# Altium schematic sheet Plasma Speaker H-Bridge.SchDoc
size A
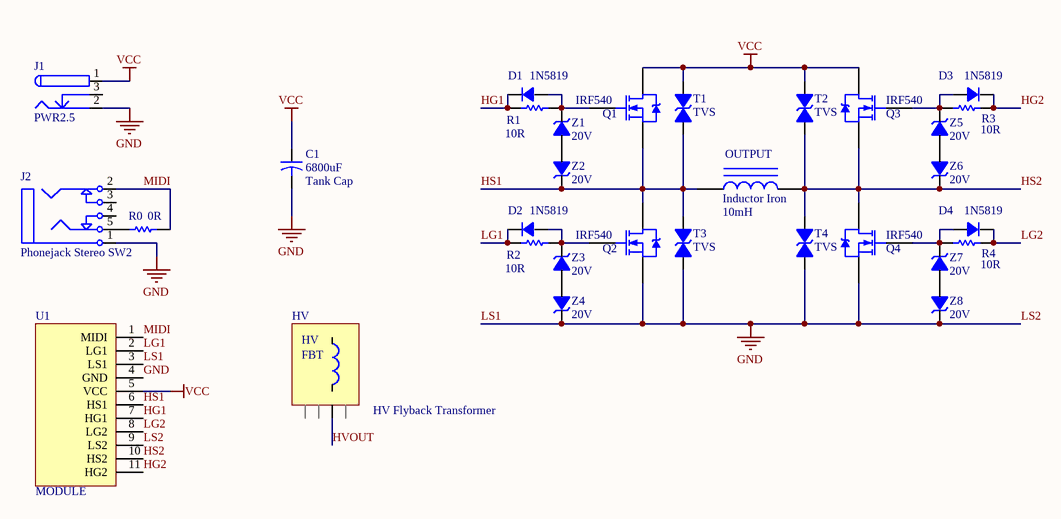
[diagram p0: Plasma Speaker H-Bridge.SchDoc]

## Parts
C1  Tank Cap  value 6800uF  [RB7.5H30]
D1  1N5819  [DO-214]
D2  1N5819  [DO-214]
D3  1N5819  [DO-214]
D4  1N5819  [DO-214]
HV  HV Flyback Transformer  [154-207E]
J1  PWR2.5  [2.5 PWR]
J2  Phonejack Stereo SW2  [Phonejack Type-1]
OUTPUT  Inductor Iron  value 10mH  [CON-3.0]
Q1  IRF540  [TO-263]
Q2  IRF540  [TO-263]
Q3  IRF540  [TO-263]
Q4  IRF540  [TO-263]
R0  value 0R  [D0805]  (hidden comment: 0603)
R1  value 10R  [D1206]  (hidden comment: 1206)
R2  value 10R  [D1206]  (hidden comment: 1206)
R3  value 10R  [D1206]  (hidden comment: 1206)
R4  value 10R  [D1206]  (hidden comment: 1206)
T1  TVS  [DO-214]
T2  TVS  [DO-214]
T3  TVS  [DO-214]
T4  TVS  [DO-214]
U1  MODULE  [Plasma Speaker Module]
Z1  20V  [D1206]
Z2  20V  [D1206]
Z3  20V  [D1206]
Z4  20V  [D1206]
Z5  20V  [D1206]
Z6  20V  [D1206]
Z7  20V  [D1206]
Z8  20V  [D1206]

## Nets
GND: C1.2 J1.2 J2.1 Q2.3(S) Q4.3(S) T3.1 T4.1 U1.3(LS1) U1.4(GND) U1.9(LS2) Z4.2 Z8.2  [also labelled LS1, LS2]
VCC: C1.1 J1.1 Q1.2(D) Q3.2(D) T1.2 T2.2 U1.5(VCC)
HG1: D1.2 R1.1 U1.7(HG1)
HG2: D3.2 R3.2 U1.11(HG2)
HS1: OUTPUT.1 Q1.3(S) Q2.2(D) T1.1 T3.2 U1.6(HS1) Z2.2
HS2: OUTPUT.2 Q3.3(S) Q4.2(D) T2.1 T4.2 U1.10(HS2) Z6.2
HVOUT: HV.1
LG1: D2.2 R2.1 U1.2(LG1)
LG2: D4.2 R4.2 U1.8(LG2)
MIDI: J2.2 R0.2 U1.1(MIDI)
NetD1_1: D1.1 Q1.1(G) R1.2 Z1.2
NetD2_1: D2.1 Q2.1(G) R2.2 Z3.2
NetD3_1: D3.1 Q3.1(G) R3.1 Z5.2
NetD4_1: D4.1 Q4.1(G) R4.1 Z7.2
NetJ2_5: J2.5 R0.1
NetZ1_1: Z1.1 Z2.1
NetZ3_1: Z3.1 Z4.1
NetZ5_1: Z5.1 Z6.1
NetZ7_1: Z7.1 Z8.1

Not connected (* = marked no-connect by the designer): J1 3; J2 3 4

## Notes on the sheet
- (in symbol 154-207E FBT) FBT

## Library data of the parts
C1 = Cap2: Capacitor; Published: 23-Sep-2002; PackageReference: CAPR5-4X5; Publisher: Altium Limited; PackageDescription: Capacitor; 2 Leads
D1-D4 = Diode S: Zener Diode; Published: 8-Jun-2000; LatestRevisionDate: 17-Jul-2002; LatestRevisionNote: Re-released for DXP Platform.; PackageReference: DIODE-0.7; Publisher: Altium Limited; PackageDescription: Diode, Thru-Hole; 2 Leads; 0.7 in Pin Spacing
HV = 154-207E FBT
J1 = PWR2.5: Low Voltage Power Supply Connector; Published: 17-Dec-2003; DatasheetDocument: 09-May-2002; Publisher: Altium Limited; ComponentLink1Description: Manufacturer Link; ComponentLink1URL: http://domino.kycon.com/internet/Products.html
J2 = Phonejack Stereo SW2: 3-Conductor Jack with 2 break contacts (normals) and 2 auxiliary make contacts; Published: 5-Jan-2004; LatestRevisionDate: 17-Dec-2003; LatestRevisionNote: PCB Footprint replaced.; DatasheetDocument: 07-Mar-2000; Publisher: Altium Limited; ComponentLink1Description: Manufacturer Link; ComponentLink1URL: http://domino.kycon.com/internet/Products.html
OUTPUT = Inductor Iron: Magnetic-Core Inductor; Published: 24-Mar-1999; LatestRevisionDate: 17-Jul-2002; LatestRevisionNote: Re-released for DXP Platform.; PackageReference: AXIAL-0.9; Publisher: Altium Limited; PackageDescription: Axial Device, Thru-Hole; 2 Leads; 0.9 in Pin Spacing
Q1-Q4 = NMOS-2: N-Channel Power MOSFET; Note: Pin 2 is electrically connected to pin 4.; Published: 8-Jun-2000; LatestRevisionDate: 17-Jul-2002; LatestRevisionNote: Re-released for DXP Platform.; DatasheetVersion: PD-9.814; PackageVersion: Feb-1997; PackageReference: TO-220AB; Publisher: Altium Limited; PackageDescription: TO, Thru-Hole, Vertical, Heatsink Mounted; 3 In-Line Leads; Pitch 2.54 mm; ComponentLink1Description: Manufacturer Link; ComponentLink1URL: http://www.irf.com/
R0-R4 = Res1: Resistor; Published: 8-Jun-2000; LatestRevisionDate: 17-Jul-2002; LatestRevisionNote: Re-released for DXP Platform.; PackageReference: AXIAL-0.3; Publisher: Altium Limited; PackageDescription: Axial Device, Thru-Hole; 2 Leads; 0.3 in Pin Spacing
T1-T4 = TVS Diode: Published: 8-Jun-2000; LatestRevisionDate: 17-Jul-2002; LatestRevisionNote: Re-released for DXP Platform.; PackageReference: DIODE-0.7; Publisher: Altium Limited; PackageDescription: Diode, Thru-Hole; 2 Leads; 0.7 in Pin Spacing
U1 = Plasma Speaker: Plasma Speaker Signal Module
Z1-Z8 = Zener: Zener Diode; Published: 8-Jun-2000; LatestRevisionDate: 17-Jul-2002; LatestRevisionNote: Re-released for DXP Platform.; PackageReference: DIODE-0.7; Publisher: Altium Limited; PackageDescription: Diode, Thru-Hole; 2 Leads; 0.7 in Pin Spacing